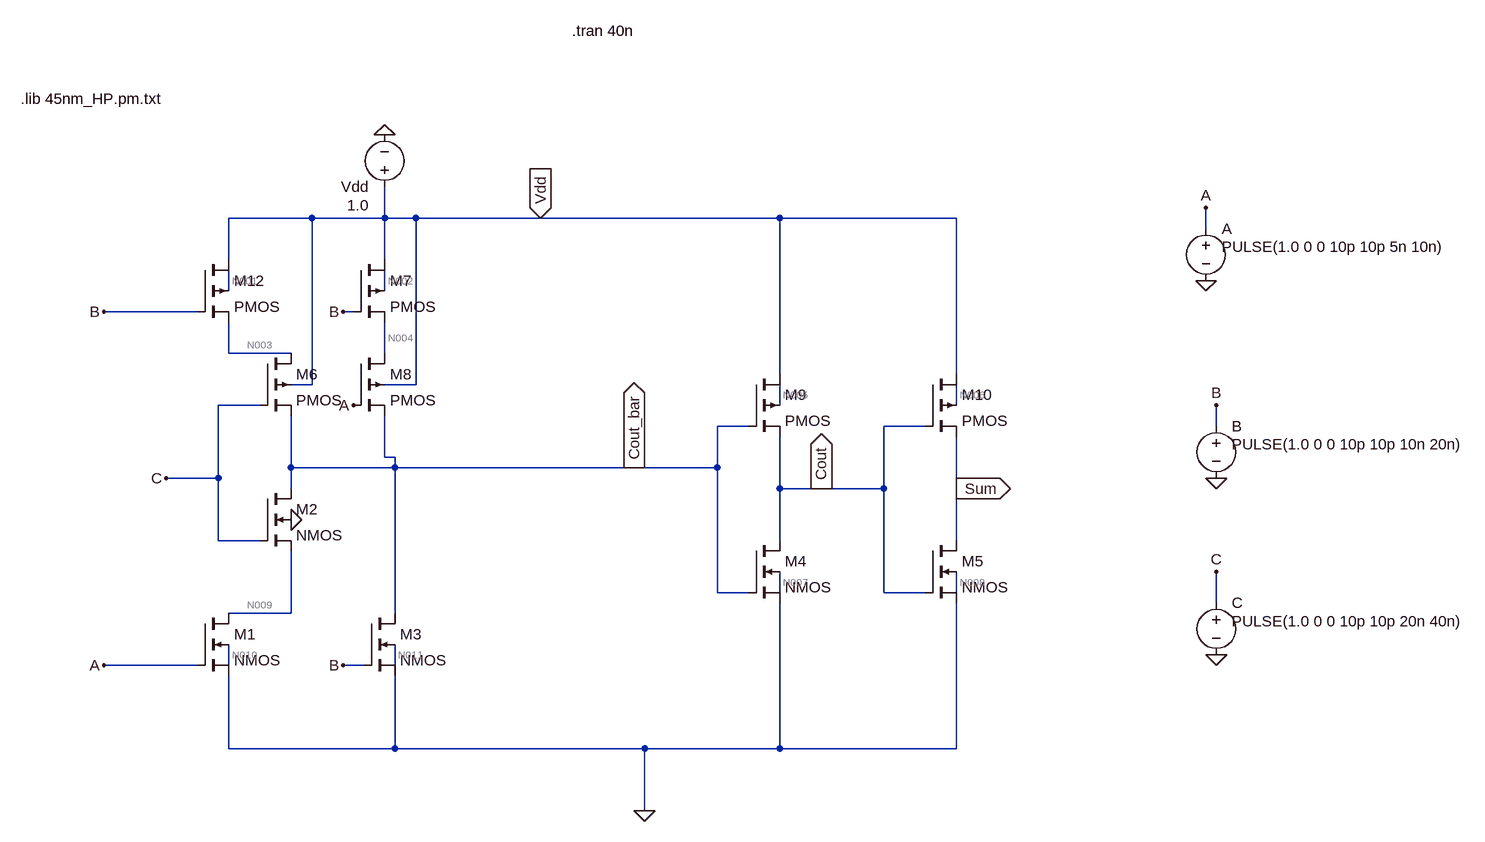
[diagram p0: schematic AMA3_45nm.asc]
AMA3_45nm.asc, the LTspice schematic file:
Version 4
SHEET 1 1044 692
WIRE -752 -240 -880 -240
WIRE -640 -240 -640 -288
WIRE -640 -240 -752 -240
WIRE -592 -240 -640 -240
WIRE -400 -240 -592 -240
WIRE -32 -240 -400 -240
WIRE 240 -240 -32 -240
WIRE 624 -224 624 -256
WIRE -880 -176 -880 -240
WIRE -640 -176 -640 -240
WIRE -880 -128 -880 -160
WIRE -640 -128 -640 -160
WIRE -928 -96 -1072 -96
WIRE -688 -96 -704 -96
WIRE -880 -32 -880 -80
WIRE -784 -32 -880 -32
WIRE -640 -32 -640 -80
WIRE -32 0 -32 -240
WIRE 240 0 240 -240
WIRE -752 16 -752 -240
WIRE -752 16 -784 16
WIRE -592 16 -592 -240
WIRE -592 16 -640 16
WIRE -832 48 -896 48
WIRE -32 48 -32 16
WIRE 240 48 240 16
WIRE -80 80 -128 80
WIRE 192 80 128 80
WIRE 640 80 640 48
WIRE -640 128 -640 64
WIRE -624 128 -640 128
WIRE -784 144 -784 64
WIRE -624 144 -624 128
WIRE -624 144 -784 144
WIRE -256 144 -624 144
WIRE -128 144 -128 80
WIRE -128 144 -256 144
WIRE -896 160 -896 48
WIRE -896 160 -976 160
WIRE -784 176 -784 144
WIRE -32 176 -32 96
WIRE 32 176 -32 176
WIRE 128 176 128 80
WIRE 128 176 32 176
WIRE 240 176 240 96
WIRE -896 256 -896 160
WIRE -832 256 -896 256
WIRE -32 256 -32 176
WIRE 240 256 240 176
WIRE -128 336 -128 144
WIRE -80 336 -128 336
WIRE -32 336 -32 304
WIRE 128 336 128 176
WIRE 192 336 128 336
WIRE 240 336 240 304
WIRE 640 352 640 304
WIRE -784 368 -784 272
WIRE -784 368 -880 368
WIRE -624 368 -624 144
WIRE -928 448 -1072 448
WIRE -880 448 -880 416
WIRE -672 448 -704 448
WIRE -624 448 -624 416
WIRE -880 576 -880 464
WIRE -624 576 -624 464
WIRE -624 576 -880 576
WIRE -240 576 -624 576
WIRE -32 576 -32 352
WIRE -32 576 -240 576
WIRE 240 576 240 352
WIRE 240 576 -32 576
WIRE -240 672 -240 576
FLAG -240 672 0
FLAG -256 144 Cout_bar
IOPIN -256 144 Out
FLAG 240 176 Sum
IOPIN 240 176 Out
FLAG 624 -144 0
FLAG 640 160 0
FLAG 640 432 0
FLAG 624 -256 A
FLAG 640 48 B
FLAG 640 304 C
FLAG -976 160 C
FLAG -400 -240 Vdd
IOPIN -400 -240 In
FLAG -640 -368 0
FLAG -784 224 0
FLAG 32 176 Cout
IOPIN 32 176 Out
FLAG -688 48 A
FLAG -1072 448 A
FLAG -1072 -96 B
FLAG -704 -96 B
FLAG -704 448 B
SYMBOL nmos4 -928 368 R0
SYMATTR InstName M1
SYMATTR Value2 l=45n w=90n
SYMBOL pmos4 -928 -176 R0
SYMATTR InstName M12
SYMATTR Value2 l=45n w=180n
SYMBOL voltage 624 -240 R0
WINDOW 3 24 44 Left 2
WINDOW 123 0 0 Left 0
WINDOW 39 0 0 Left 0
SYMATTR Value PULSE(1.0 0 0 10p 10p 5n 10n)
SYMATTR InstName A
SYMBOL voltage 640 64 R0
WINDOW 3 24 44 Left 2
WINDOW 123 0 0 Left 0
WINDOW 39 0 0 Left 0
SYMATTR Value PULSE(1.0 0 0 10p 10p 10n 20n)
SYMATTR InstName B
SYMBOL voltage 640 336 R0
WINDOW 3 24 44 Left 2
WINDOW 123 0 0 Left 0
WINDOW 39 0 0 Left 0
SYMATTR Value PULSE(1.0 0 0 10p 10p 20n 40n)
SYMATTR InstName C
SYMBOL voltage -640 -272 R180
WINDOW 3 24 -12 Left 2
WINDOW 123 0 0 Left 0
WINDOW 39 0 0 Left 0
SYMATTR Value 1.0
SYMATTR InstName Vdd
SYMBOL nmos4 -832 176 R0
SYMATTR InstName M2
SYMATTR Value2 l=45n w=90n
SYMBOL nmos4 -672 368 R0
SYMATTR InstName M3
SYMATTR Value2 l=45n w=90n
SYMBOL nmos4 -80 256 R0
SYMATTR InstName M4
SYMATTR Value2 l=45n w=90n
SYMBOL nmos4 192 256 R0
SYMATTR InstName M5
SYMATTR Value2 l=45n w=90n
SYMBOL pmos4 -832 -32 R0
SYMATTR InstName M6
SYMATTR Value2 l=45n w=180n
SYMBOL pmos4 -688 -176 R0
SYMATTR InstName M7
SYMATTR Value2 l=45n w=180n
SYMBOL pmos4 -688 -32 R0
SYMATTR InstName M8
SYMATTR Value2 l=45n w=180n
SYMBOL pmos4 -80 0 R0
SYMATTR InstName M9
SYMATTR Value2 l=45n w=180n
SYMBOL pmos4 192 0 R0
SYMATTR InstName M10
SYMATTR Value2 l=45n w=180n
TEXT -1200 -424 Left 2 !.lib 45nm_HP.pm.txt
TEXT -352 -528 Left 2 !.tran 40n

The netlist it stands for:
* AMA3_45nm.asc
M1 N009 A 0 N010 NMOS l=45n w=90n
M12 Vdd B N003 N001 PMOS l=45n w=180n
V§A A 0 PULSE(1.0 0 0 10p 10p 5n 10n)
V§B B 0 PULSE(1.0 0 0 10p 10p 10n 20n)
V§C C 0 PULSE(1.0 0 0 10p 10p 20n 40n)
Vdd Vdd 0 1.0
M2 Cout_bar C N009 0 NMOS l=45n w=90n
M3 Cout_bar B 0 N011 NMOS l=45n w=90n
M4 Cout Cout_bar 0 N007 NMOS l=45n w=90n
M5 Sum Cout 0 N008 NMOS l=45n w=90n
M6 N003 C Cout_bar Vdd PMOS l=45n w=180n
M7 Vdd B N004 N002 PMOS l=45n w=180n
M8 N004 A Cout_bar Vdd PMOS l=45n w=180n
M9 Vdd Cout_bar Cout N005 PMOS l=45n w=180n
M10 Vdd Cout Sum N006 PMOS l=45n w=180n
.model NMOS NMOS
.model PMOS PMOS
.lib standard.mos
.lib 45nm_HP.pm.txt
.tran 40n
.backanno
.end

* Results of the author's LTspice run, read from the files saved beside the schematic
* Operating Point, zero values left out:
*   V(n009) = 554.3 nV
*   V(a) = 1 V
*   V(n010) = 161.1 mV
*   V(vdd) = 1 V
*   V(b) = 1 V
*   V(n003) = 911.6 mV
*   V(n001) = 887.9 mV
*   V(c) = 1 V
*   V(cout_bar) = 1.048 µV
*   V(n011) = 161.1 mV
*   V(cout) = 1 V
*   V(n007) = 260.1 mV
*   V(sum) = 5.202 µV
*   V(n008) = 161.1 mV
*   V(n004) = 911.6 mV
*   V(n002) = 887.9 mV
*   V(n005) = 840.1 mV
*   V(n006) = 868.5 mV
*   Id(M10) = 1.882 nA
*   Ig(M10) = 124.8 pA
*   Is(M10) = -2.006 nA
*   Id(M9) = 10.9 nA
*   Ig(M9) = -254.6 pA
*   Is(M9) = -10.65 nA
*   Id(M8) = 22.05 pA
*   Ig(M8) = 125.2 pA
*   Ib(M8) = 1.098 pA
*   Is(M8) = -148.3 pA
*   Id(M7) = 22.52 pA
*   Is(M7) = -22.05 pA
*   Id(M6) = 22.05 pA
*   Ig(M6) = 125.2 pA
*   Ib(M6) = 1.098 pA
*   Is(M6) = -148.3 pA
*   Id(M12) = 22.52 pA
*   Is(M12) = -22.05 pA
*   Id(M5) = 2.006 nA
*   Ig(M5) = 29.86 pA
*   Is(M5) = -2.036 nA
*   Id(M4) = 10.49 nA
*   Ig(M4) = -12.8 pA
*   Is(M4) = -10.48 nA
*   Id(M3) = 390.2 pA
*   Ig(M3) = 29.87 pA
*   Is(M3) = -419.9 pA
*   Id(M2) = 173.9 pA
*   Ig(M2) = 30.97 pA
*   Ib(M2) = -6.651 pA
*   Is(M2) = -198.2 pA
*   Id(M1) = 198.2 pA
*   Ig(M1) = 29.87 pA
*   Is(M1) = -227.9 pA
*   I(Vdd) = -12.83 nA
*   I(C) = -156.2 pA
*   I(B) = -30.71 pA
*   I(A) = -155.1 pA
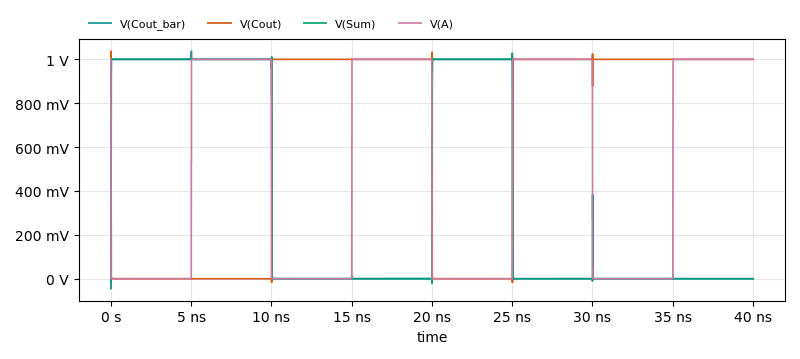
[diagram p1: Transient Analysis of AMA3_45nm.asc, plotted from the saved traces]
* Transient Analysis, 1 run:
*   V(Cout_bar): min -46.17 mV, max 1.037 V, average 375.7 mV, rms 612.6 mV, last 2.306 µV
*   V(Cout): min -17.07 mV, max 1.037 V, average 624.3 mV, rms 789.9 mV, last 1 V
*   V(Sum): min -20.27 mV, max 1.011 V, average 375.7 mV, rms 612.7 mV, last 5.277 µV
*   V(A): min 0 V, max 1 V, average 499 mV, rms 706.2 mV, last 1 V